# Altium schematic sheet ThermoDisplay.SchDoc
size 299 x 199 mm
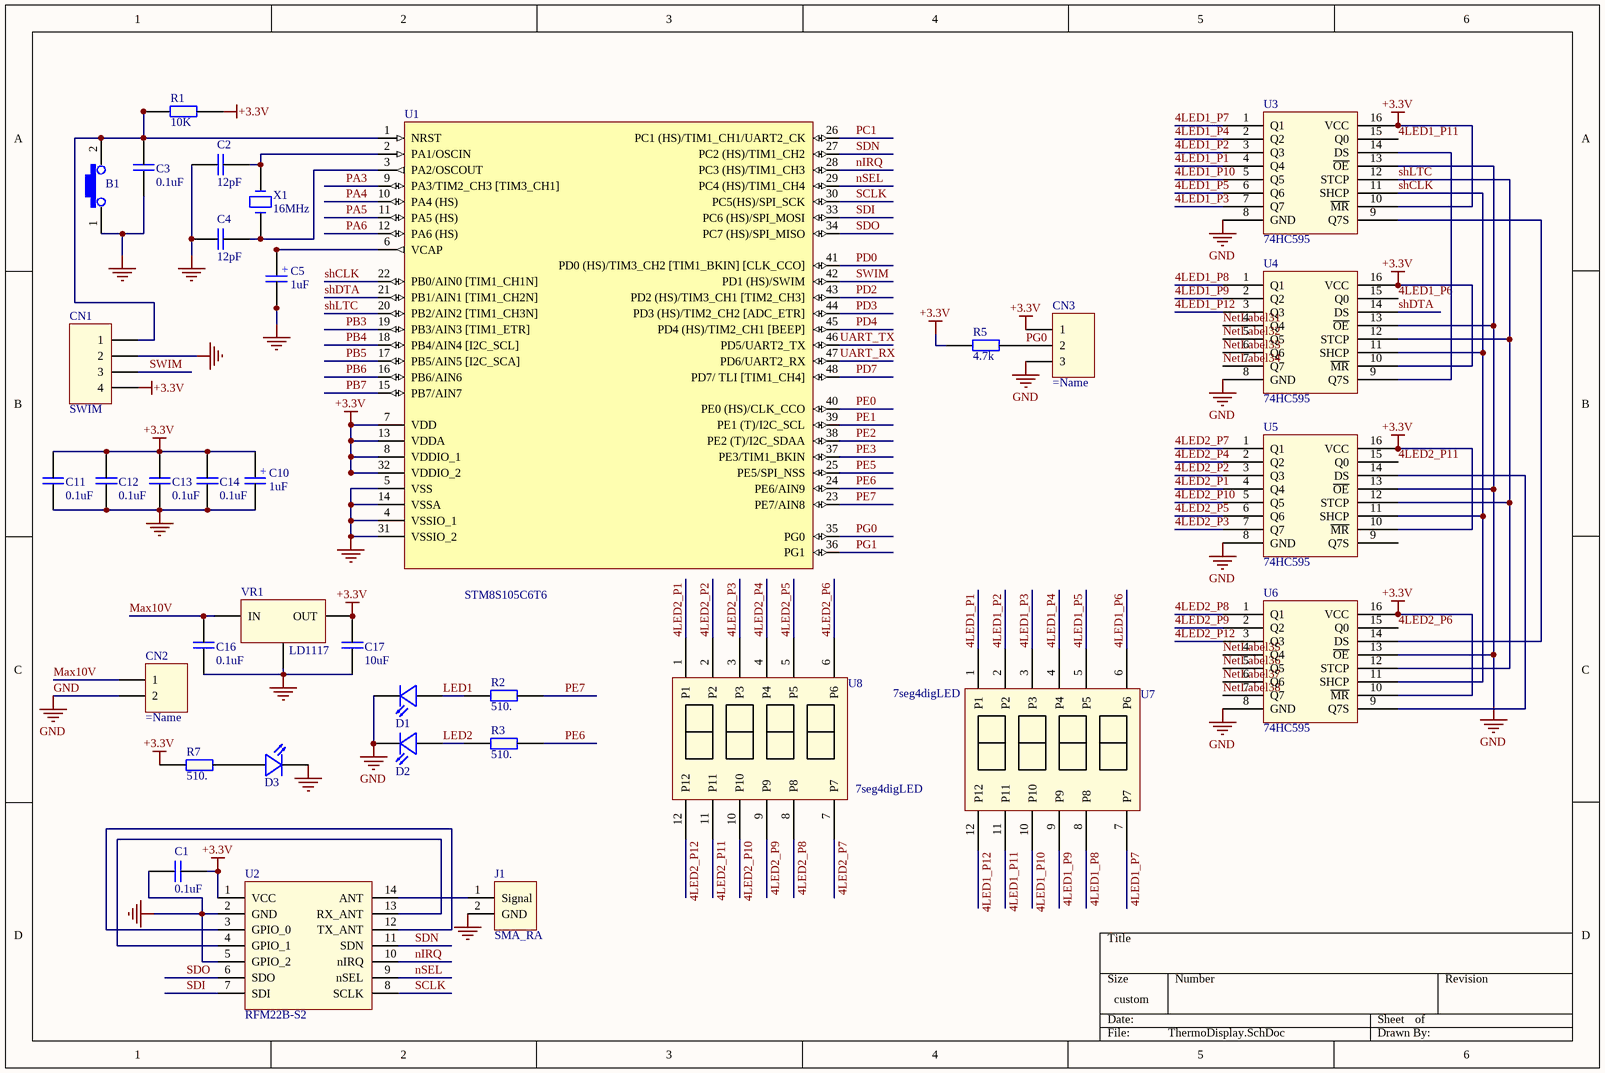
[diagram p0: ThermoDisplay.SchDoc]

## Parts
B1  (no value)  [FSMSM]
C1  0.1uF  [Cap0805]
C2  12pF  [Cap0805]
C3  0.1uF  [Cap0805]
C4  12pF  [Cap0805]
C5  1uF  [TC_A]
C10  1uF  [TC_A]
C11  0.1uF  [Cap0805]
C12  0.1uF  [Cap0805]
C13  0.1uF  [Cap0805]
C14  0.1uF  [Cap0805]
C16  0.1uF  [Cap0805]
C17  10uF  [Cap0805]
CN1  SWIM  [PLS-4 - bottom]
CN2  (no value)  [PLS-2]
CN3  (no value)  [PLS-3]
D1  Green  [FYLS-0805]  (value not drawn)
D2  Yellow  [FYLS-0805]  (value not drawn)
D3  Red  [FYLS-0805]  (value not drawn)
J1  SMA_RA  [SMA_RA]
R1  10K  [Res0805]
R2  510.  [Res0805]
R3  510.  [Res0805]
R5  4.7k  [RES0805]
R7  510.  [Res0805]
U1  STM8S105C6T6  [LQFP48_H]
U2  RFM22B-S2  [RFM22B-S2]
U3  74HC595  [SO-16_M]
U4  74HC595  [SO-16_M]
U5  74HC595  [SO-16_M]
U6  74HC595  [SO-16_M]
U7  7seg4digLED  [LD3361BS]
U8  7seg4digLED  [LD3361BS]
VR1  LD1117  [SOT223_M]
X1  16MHz  [KX-7]

## Nets
+3.3V: C1.2 C10.1 C11.2 C12.2 C13.2 C14.2 C17.2 CN1.4 CN3.1 R1.2 R5.1 R7.1 U1.7(VDD) U1.8(VDDIO_1) U1.13(VDDA) U1.32(VDDIO_2) U2.1(VCC) U3.10(~{MR}) U3.16(VCC) U4.10(~{MR}) U4.16(VCC) U5.10(~{MR}) U5.16(VCC) U6.10(~{MR}) U6.16(VCC) VR1.3(OUT)
GND: B1.1 C1.1 C2.1 C3.1 C4.1 C5.2 C10.2 C11.1 C12.1 C13.1 C14.1 C16.1 C17.1 CN1.2 CN2.2 CN3.3 D1.2 D2.2 D3.2 J1.2(GND) U1.4(VSSIO_1) U1.5(VSS) U1.14(VSSA) U1.31(VSSIO_2) U2.2(GND) U2.5(GPIO_2) U3.8(GND) U3.13(~{OE}) U4.8(GND) U4.13(~{OE}) U5.8(GND) U5.13(~{OE}) U6.8(GND) U6.13(~{OE}) VR1.2(GND)
4LED1_P1: U3.4(Q4) U7.1(P1)
4LED1_P2: U3.3(Q3) U7.2(P2)
4LED1_P3: U3.7(Q7) U7.3(P3)
4LED1_P4: U3.2(Q2) U7.4(P4)
4LED1_P5: U3.6(Q6) U7.5(P5)
4LED1_P6: U4.15(Q0) U7.6(P6)
4LED1_P7: U3.1(Q1) U7.7(P7)
4LED1_P8: U4.1(Q1) U7.8(P8)
4LED1_P9: U4.2(Q2) U7.9(P9)
4LED1_P10: U3.5(Q5) U7.10(P10)
4LED1_P11: U3.15(Q0) U7.11(P11)
4LED1_P12: U4.3(Q3) U7.12(P12)
4LED2_P1: U5.4(Q4) U8.1(P1)
4LED2_P2: U5.3(Q3) U8.2(P2)
4LED2_P3: U5.7(Q7) U8.3(P3)
4LED2_P4: U5.2(Q2) U8.4(P4)
4LED2_P5: U5.6(Q6) U8.5(P5)
4LED2_P6: U6.15(Q0) U8.6(P6)
4LED2_P7: U5.1(Q1) U8.7(P7)
4LED2_P8: U6.1(Q1) U8.8(P8)
4LED2_P9: U6.2(Q2) U8.9(P9)
4LED2_P10: U5.5(Q5) U8.10(P10)
4LED2_P11: U5.15(Q0) U8.11(P11)
4LED2_P12: U6.3(Q3) U8.12(P12)
LED1: D1.1 R2.1
LED2: D2.1 R3.1
Max10V: C16.2 CN2.1 VR1.1(IN)
NetLabel31: U4.4(Q4)
NetLabel32: U4.5(Q5)
NetLabel33: U4.6(Q6)
NetLabel34: U4.7(Q7)
NetLabel35: U6.4(Q4)
NetLabel36: U6.5(Q5)
NetLabel37: U6.6(Q6)
NetLabel38: U6.7(Q7)
nIRQ: U1.28(PC3_(HS)/TIM1_CH3) U2.10(nIRQ)
nSEL: U1.29(PC4_(HS)/TIM1_CH4) U2.9(nSEL)
PA3: U1.9(PA3/TIM2_CH3_[TIM3_CH1])
PA4: U1.10(PA4_(HS))
PA5: U1.11(PA5_(HS))
PA6: U1.12(PA6_(HS))
PB3: U1.19(PB3/AIN3_[TIM1_ETR])
PB4: U1.18(PB4/AIN4_[I2C_SCL])
PB5: U1.17(PB5/AIN5_[I2C_SCA])
PB6: U1.16(PB6/AIN6)
PB7: U1.15(PB7/AIN7)
PC1: U1.26(PC1_(HS)/TIM1_CH1/UART2_CK)
PD0: U1.41(PD0_(HS)/TIM3_CH2_[TIM1_BKIN]_[CLK_CCO])
PD2: U1.43(PD2_(HS)/TIM3_CH1_[TIM2_CH3])
PD3: U1.44(PD3_(HS)/TIM2_CH2_[ADC_ETR])
PD4: U1.45(PD4_(HS)/TIM2_CH1_[BEEP])
PD7: U1.48(PD7/_TLI_[TIM1_CH4])
PE0: U1.40(PE0_(HS)/CLK_CCO)
PE1: U1.39(PE1_(T)/I2C_SCL)
PE2: U1.38(PE2_(T)/I2C_SDAA)
PE3: U1.37(PE3/TIM1_BKIN)
PE5: U1.25(PE5/SPI_NSS)
PE6: R3.2 U1.24(PE6/AIN9)
PE7: R2.2 U1.23(PE7/AIN8)
PG0: CN3.2 R5.2 U1.35(PG0)
PG1: U1.36(PG1)
SCLK: U1.30(PC5(HS)/SPI_SCK) U2.8(SCLK)
SDI: U1.33(PC6_(HS)/SPI_MOSI) U2.7(SDI)
SDN: U1.27(PC2_(HS)/TIM1_CH2) U2.11(SDN)
SDO: U1.34(PC7_(HS)/SPI_MISO) U2.6(SDO)
shCLK: U1.22(PB0/AIN0_[TIM1_CH1N]) U3.11(SHCP) U4.11(SHCP) U5.11(SHCP) U6.11(SHCP)
shDTA: U1.21(PB1/AIN1_[TIM1_CH2N]) U4.14(DS)
shLTC: U1.20(PB2/AIN2_[TIM1_CH3N]) U3.12(STCP) U4.12(STCP) U5.12(STCP) U6.12(STCP)
SWIM: CN1.3 U1.42(PD1_(HS)/SWIM)
UART_RX: U1.47(PD6/UART2_RX)
UART_TX: U1.46(PD5/UART2_TX)
NetB1_2: B1.2 C3.2 CN1.1 R1.1 U1.1(NRST)
NetC2_2: C2.2 U1.2(PA1/OSCIN) X1.2
NetC4_2: C4.2 U1.3(PA2/OSCOUT) X1.1
NetC5_1: C5.1 U1.6(VCAP)
NetD3_1: D3.1 R7.2
NetJ1_1: J1.1(Signal) U2.14(ANT)
NetU2_3: U2.3(GPIO_0) U2.12(TX_ANT)
NetU2_4: U2.4(GPIO_1) U2.13(RX_ANT)
NetU3_9: U3.9(Q7S) U6.14(DS)
NetU3_14: U3.14(DS) U4.9(Q7S)
NetU5_14: U5.14(DS) U6.9(Q7S)

Not connected (* = marked no-connect by the designer): U5 9(Q7S)

## Notes on the sheet
- (in symbol TCap TC_A 1uF) +

## Library data of the parts
B1 = FSM14JRT: Button; ComponentLink1Description1: Datasheet; Part Number: FSM14JRT; Type: FSM14JRT; ComponentLink1URL: http://www.compel.ru/infosheet/TYCO/FSM14JRT/; ComponentLink1Description: Компэл; ComponentLink2URL: http://www.te.com/catalog/pn/en/1571010-1
C1 C3 C11-C14 C16 = Cap 0805 0.1uF: Capacitor; Tolerance: ±5%; Voltage: 50V; Type: CC0805JRX7R9BB104; Part Number: Cap 0805 0.1uF; Value: 0.1uF; ComponentLink1URL: http://www.compel.ru/infosheet/YAG/CC0805JRX7R9BB104/; ComponentLink1Description: Компэл
C2 C4 = Cap 0805 12pF: Capacitor; Tolerance: ±5%; Voltage: 50V; Type: CC0805JRNPO9BN120; Part Number: Cap 0805 12pF; Value: 12pF; ComponentLink1URL: http://www.compel.ru/infosheet/YAG/CC0805JRNPO9BN120/; ComponentLink1Description: Компэл
C5 C10 = TCap TC_A 1uF: Capacitor polarity; Voltage: 25V; Tolerance: ±10%; Type: 293D105X9025A2TE3; Part Number: TCap TC_A 1uF; Value: 1uF; ComponentLink1URL: http://www.compel.ru/infosheet/VISHAY/293D105X9025A2TE3/; ComponentLink1Description: Компэл
C17 = Cap 0805 10uF: Capacitor; Tolerance: ±10%; Voltage: 16V; Type: CC0805KKX5R7BB106; Part Number: Cap 0805 10uF; Value: 10uF; ComponentLink1URL: http://www.compel.ru/infosheet/YAG/CC0805KKX5R7BB106/; ComponentLink1Description: Компэл
CN1 = SWIM: PLS-4; Part Number: SWIM; Name: SWIM; Type: PLS; ComponentLink1Description: Компэл; ComponentLink1URL: http://www.compel.ru/infosheet/BM/PLS-40/; Quantity: 4
CN2 = PLS-2: Part Number: PLS-2; Type: PLS; ComponentLink1URL: http://www.compel.ru/infosheet/BM/PLS-40/; ComponentLink1Description: Компэл
CN3 = PLS-3: Part Number: PLS-3; Type: PLS; ComponentLink1URL: http://www.compel.ru/infosheet/BM/PLS-40/; ComponentLink1Description: Компэл
D1 = FYLS-0805UGC: LED; ComponentLink1Description1: Datasheet; Part Number: FYLS-0805UGC; Type: FYLS-0805UGC; ComponentLink1URL: http://www.compel.ru/infosheet/FORYARD/FYLS-0805UGC/; ComponentLink1Description: Компэл; ComponentLink2URL: http://z.compel.ru/item-pdf/40382bfb8e3db1edc936af55f65492cc/pn/foryard~fyls-0805ugc.pdf; Name: Green
D2 = FYLS-0805UYC: LED; ComponentLink1Description1: Datasheet; Part Number: FYLS-0805UYC; Type: FYLS-0805UYC; ComponentLink1URL: http://www.compel.ru/infosheet/FORYARD/FYLS-0805UYC/; ComponentLink1Description: Компэл; ComponentLink2URL: http://z.compel.ru/item-pdf/c384b917e1168d6af4dfaca57515c5c1/pn/foryard~fyls-0805uyc.pdf; Name: Yellow
D3 = FYLS-0805URC: LED; ComponentLink1Description1: Datasheet; Part Number: FYLS-0805URC; Type: FYLS-0805URC; ComponentLink1URL: http://www.compel.ru/infosheet/FORYARD/FYLS-0805URC/; ComponentLink1Description: Компэл; ComponentLink2URL: http://z.compel.ru/item-pdf/2b6f7c43e3d977eccc24365238bab840/pn/foryard~fyls-0805urc.pdf; Name: Red
J1 = SMA RIGHT ANGEL PCB: ComponentLink1Description1: Datasheet; Part Number: SMA RIGHT ANGEL PCB; Name: SMA_RA; Type: 5-1814400-1; ComponentLink1URL: http://www.compel.ru/infosheet/TYCO/5-1814400-1/; ComponentLink1Description: Компэл; ComponentLink2URL: http://www.te.com/catalog/pn/en/5-1814400-1
R1 = Res 0805 10K: Resistor; Tolerance: ± 1%; Power: 125mW; Part Number: Res 0805 10K; Value: 10K; ComponentLink1URL: http://www.compel.ru/infosheet/YAG/RC0805FR-0710KL/; ComponentLink1Description: Компэл; Type: RC0805FR-0710KL
R2 R3 R7 = Res 0805 510: Resistor; Tolerance: ± 5%; Power: 125mW; Part Number: Res 0805 510; Value: 510.; ComponentLink1URL: http://www.compel.ru/infosheet/YAG/RC0805JR-07510RL/; ComponentLink1Description: Компэл; Type: RC0805JR-07510RL
R5 = Resistor
U1 = STM8S105C6T6: Microcontroller; ComponentLink1Description1: Datasheet; Part Number: STM8S105C6T6; Name: STM8S105C6T6; Type: STM8S105C6T6; ComponentLink1URL: http://www.compel.ru/infosheet/ST/STM8S105C6T6/; ComponentLink1Description: Компэл; ComponentLink2URL: http://www.st.com/web/catalog/mmc/FM141/SC1244/SS1010/LN754/PF215105?s_searchtype=partnumber#
U2 = RFM22B-S2: Transmitter; ComponentLink1Description1: Datasheet; Part Number: RFM22B-S2; Name: RFM22B-S2; Type: RFM22B-S2; ComponentLink1URL: http://www.hoperf.com/rf/fsk_module/RFM22B.htm; ComponentLink1Description: HopeRF; ComponentLink2URL: http://www.hoperf.com/rf/fsk_module/RFM22B.htm
U3-U6 = 74HC595: Shift Register; Name: 74HC595
U7 U8 = 7SEG4LED: 7 segment 4-digit LED; Name: 7seg4digLED
VR1 = LD1117: Voltage Regulator; ComponentLink1Description1: Datasheet; Part Number: LD1117; Name: LD1117; Type: LD1117; ComponentLink1URL: http://www.compel.ru/infosheet/ST/LD1117S33TR/; ComponentLink1Description: Компэл; ComponentLink2URL: http://z.compel.ru/item-pdf/c5cac29eedcfd1e06cc4e0a5c83fbfc9/ps/st~ld1117xx33.pdf
X1 = KX-7T 16.0 MHz: XTAL; Part Number: KX-7T 16.0 MHz; Type: KX-7T 16.0 MHz; ComponentLink1URL: http://www.compel.ru/infosheet/GEYER/KX-7T%2016.0%20MHz%2050%2F100%2F100%2012%20pF/; ComponentLink1Description: Компэл; Name: 16MHz